# EAGLE design power_supply (EAGLE 7.5.0)
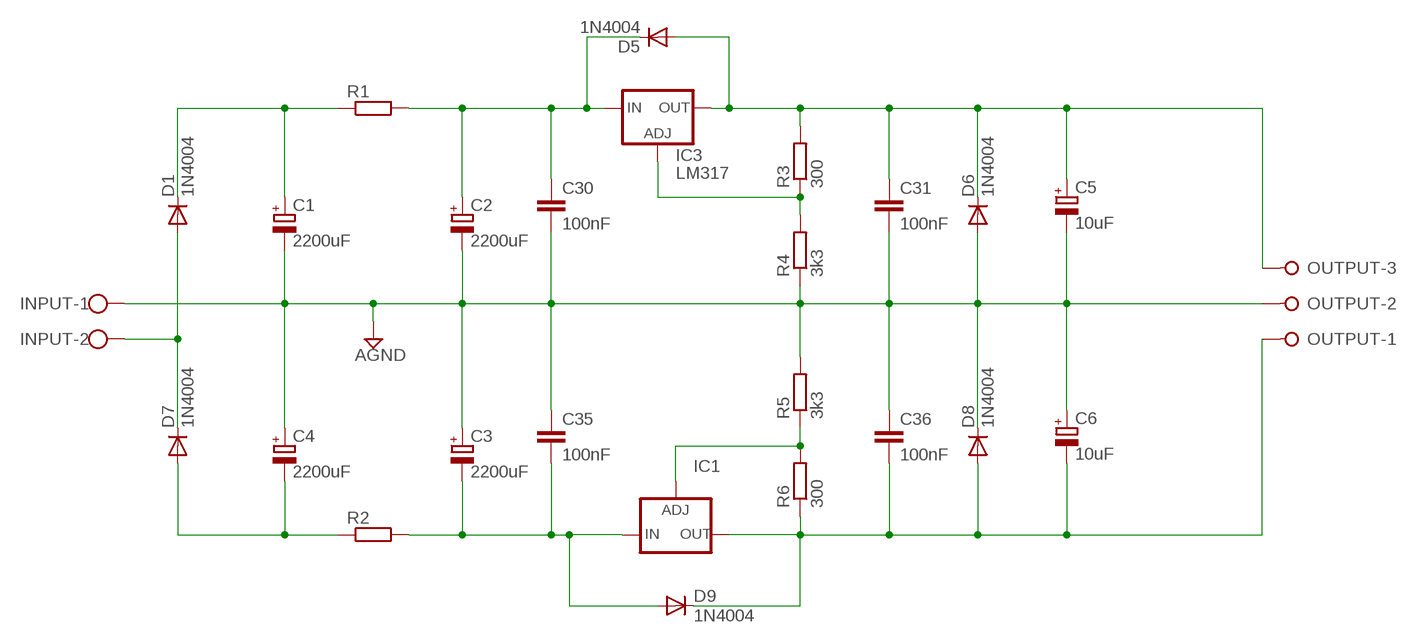
[diagram p0: schematic, sheet 1]

## Parts
C1  2200uF  CPOL-EUE7.5-16  [E7,5-16]
C2  2200uF  CPOL-EUE7.5-16  [E7,5-16]
C3  2200uF  CPOL-EUE7.5-16  [E7,5-16]
C4  2200uF  CPOL-EUE7.5-16  [E7,5-16]
C5  10uF  CPOL-EUE2.5-5  [E2,5-5]
C6  10uF  CPOL-EUE2.5-5  [E2,5-5]
C30  100nF  C-EU050-025X075  [C050-025X075]
C31  100nF  C-EU050-025X075  [C050-025X075]
C35  100nF  C-EU050-025X075  [C050-025X075]
C36  100nF  C-EU050-025X075  [C050-025X075]
D1  1N4004  [DO41-10]
D5  1N4004  [DO41-10]
D6  1N4004  [DO41-10]
D7  1N4004  [DO41-10]
D8  1N4004  [DO41-10]
D9  1N4004  [DO41-10]
IC1  LM337TS  [337TS]
IC3  LM317  LM317TS  [317TS]
INPUT  W237-102  [W237-102]
OUTPUT  W237-3E  [W237-3E]
R1  R-EU_0207/10  [0207/10]
R2  R-EU_0207/10  [0207/10]
R3  300  R-EU_0207/7  [0207/7]
R4  3k3  R-EU_0207/7  [0207/7]
R5  3k3  R-EU_0207/7  [0207/7]
R6  300  R-EU_0207/7  [0207/7]

## Nets
AGND: C1.- C2.- C3.+ C4.+ C5.- C6.+ C30.2 C31.2 C35.1 C36.1 D6.A D8.C INPUT.1 OUTPUT.2 R4.1 R5.2
N$1: IC1.1(ADJ) R5.1 R6.2
N$2: D1.A D7.C INPUT.2
N$3: C6.- C36.2 D8.A D9.C IC1.3(OUT) OUTPUT.1 R6.1
N$5: C5.+ C31.1 D5.A D6.C IC3.2(OUT) OUTPUT.3 R3.2
N$6: C2.+ C30.1 D5.C IC3.3(IN) R1.2
N$7: IC3.1(ADJ) R3.1 R4.2
N$8: C1.+ D1.C R1.1
N$9: C3.- C35.2 D9.A IC1.2(IN) R2.2
N$10: C4.- D7.A R2.1

## Library data of the parts
C1-C6 = rcl:CPOL-EU: POLARIZED CAPACITOR, European symbol
C30 C31 C35 C36 = rcl:C-EU: CAPACITOR, European symbol
D1 D5-D9 = adafruit:1N4004: DIODE General purpose 1N400x type rectifier (With bigger pads) http://www.ladyada.net/library/pcb/eaglelibrary.html
IC1 = v-reg:LM337TS: VOLTAGE REGULATOR
IC3 = v-reg:LM317TS: VOLTAGE REGULATOR
INPUT = con-wago-500:W237-102: WAGO SCREW CLAMP; MPN: 237-102; OC_FARNELL: unknown; OC_NEWARK: 70K9898
OUTPUT = con-wago-508:W237-3E: WAGO SREW CLAMP; OC_FARNELL: unknown; OC_NEWARK: unknown
R1-R6 = rcl:R-EU_: RESISTOR, European symbol

## Board
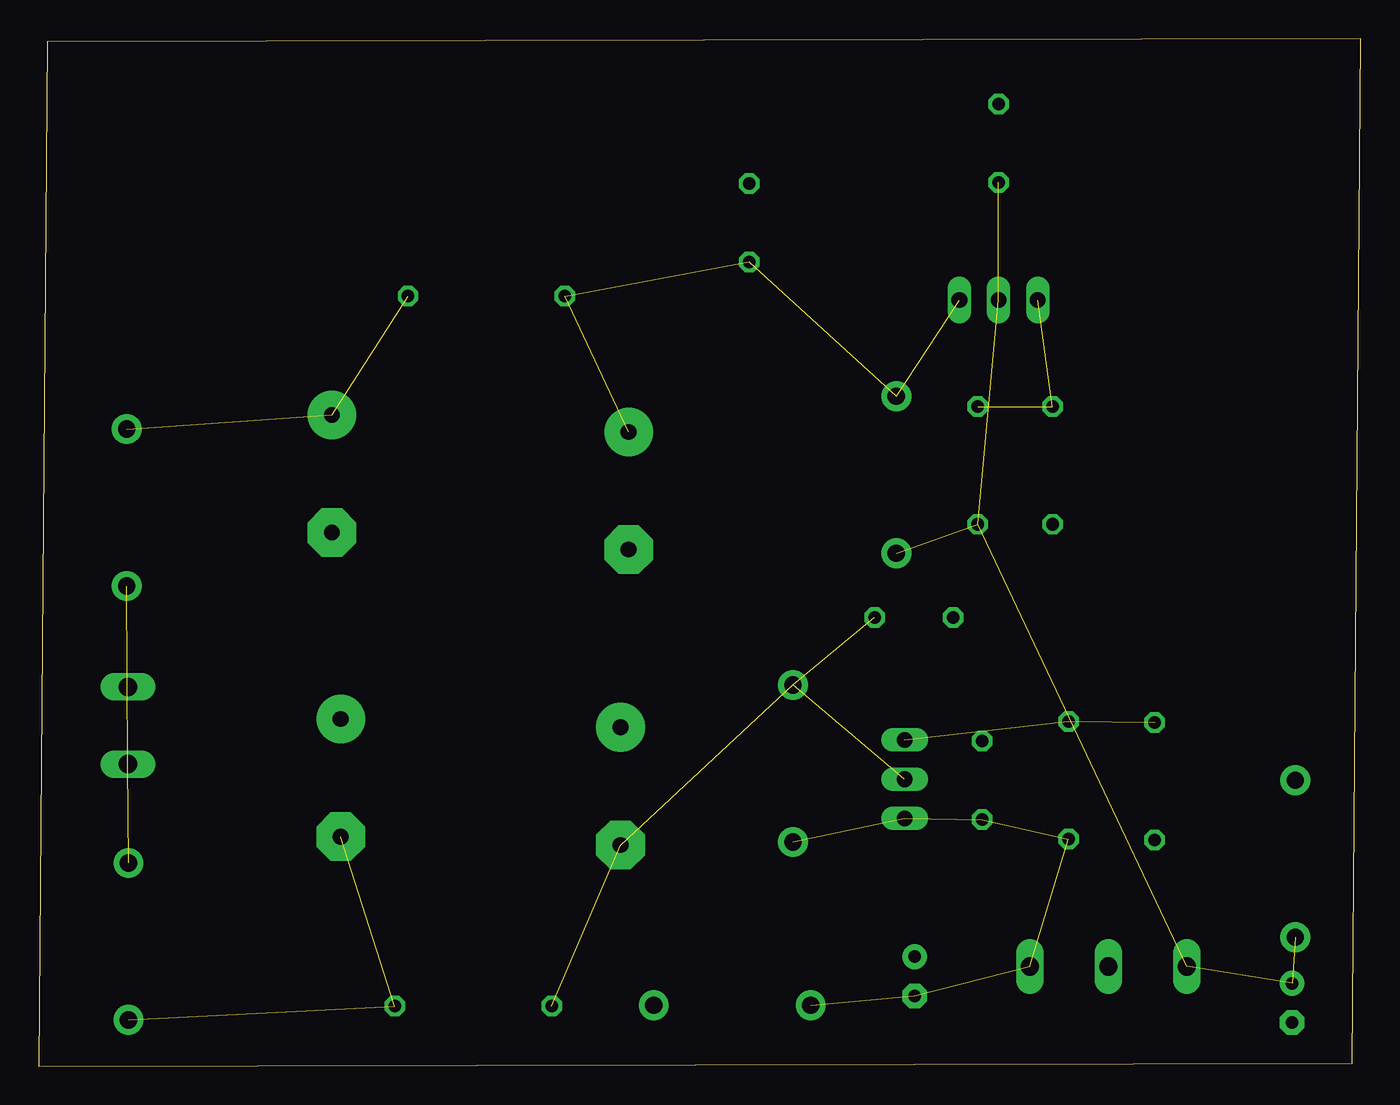
[diagram p1: board, top side]
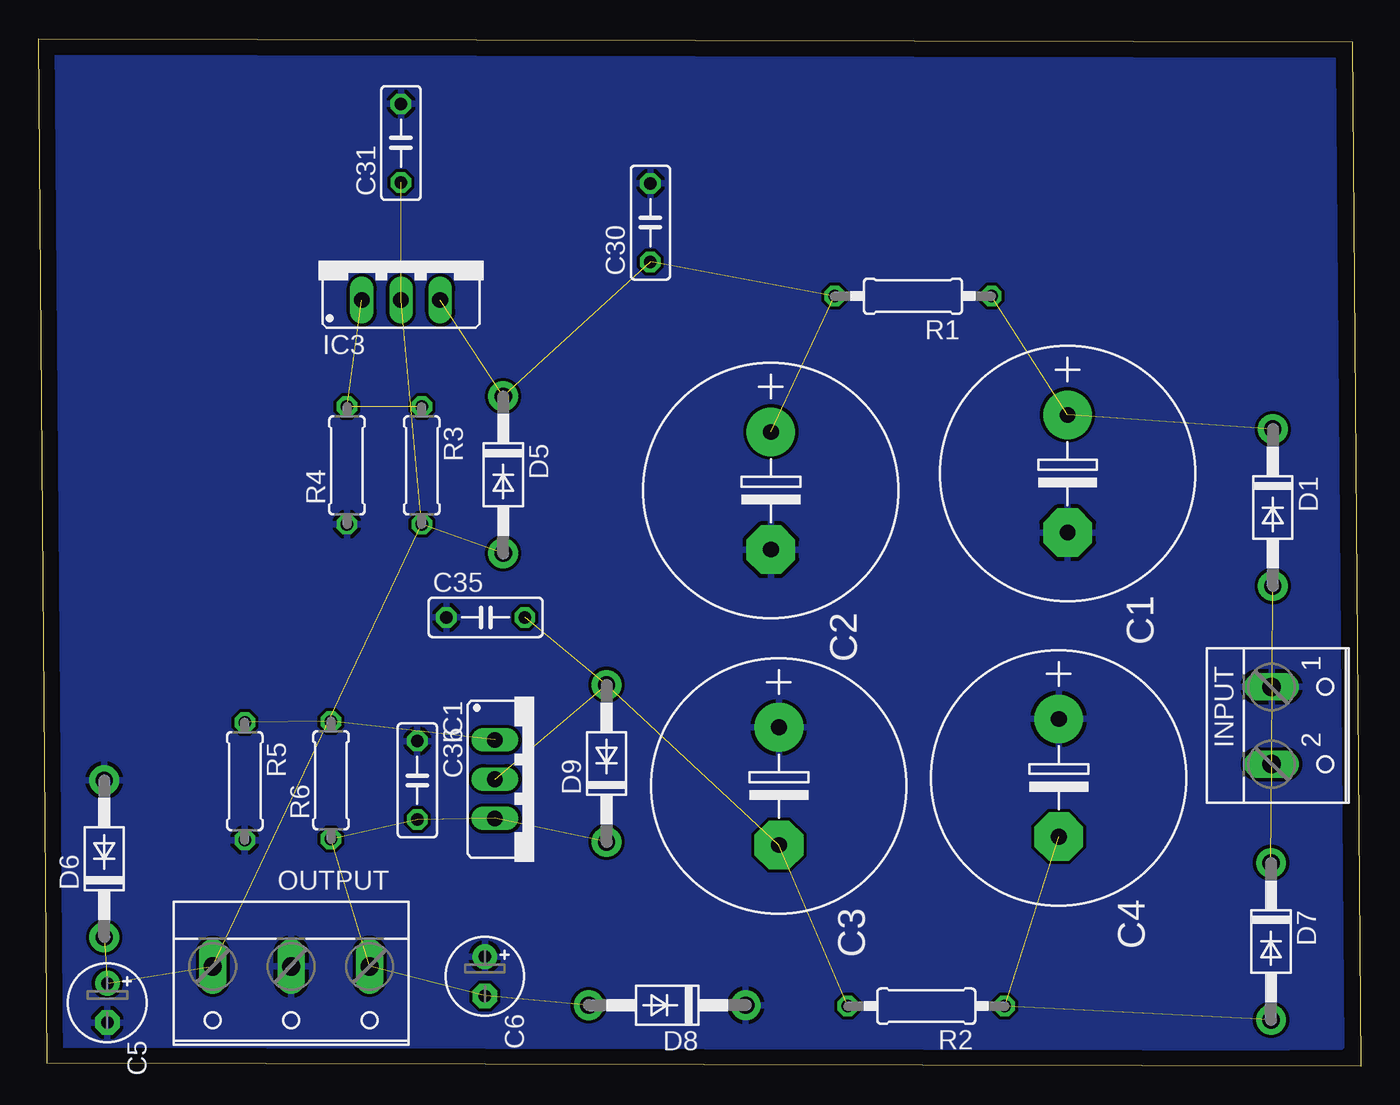
[diagram p2: board, bottom side, seen from below]

Size 85.61 x 66.51 mm. Coordinates in mm from the lower left corner, seen from the top.
Outline: 0,0 85.04,0.19 85.61,66.51 0.57,66.32 0,0
Copper layers (1*16): Top 0.035mm / dielectric 1.5mm / Bottom 0.035mm
Design rules "default": minimum track width 10mil, minimum drill 24mil, track to track 8mil, track to pad 8mil, pad to pad 8mil, via to via 8mil, smd to smd 8mil, copper to edge 40mil, drill to drill 8mil, minimum pad ring 10mil, minimum via ring 8mil, stop-mask expansion 4mil, vias tented up to drill 0mil, thermal gap 10mil

### Footprints (pad centres in the part's own frame; a part is rotated, then mirrored left to right if it is on the bottom)
E7,5-16 = drill 1.016 pad 3.15: + -3.81,0 | drill 1.016 pad 3.15 octagon: - 3.81,0
E2,5-5 = drill 0.813 pad 1.6: + -1.27,0 | drill 0.813 pad 1.6 octagon: - 1.27,0
C050-025X075 = drill 0.813 octagon: 1 -2.54,0; 2 2.54,0
DO41-10 = drill 1.118 pad 1.93: A 5.08,0; C -5.08,0
337TS = drill 1.016 long: 1 -2.54,-2.54; 2 0,-2.54; 3 2.54,-2.54
317TS = drill 1.016 long: 1 -2.54,-2.54; 2 0,-2.54; 3 2.54,-2.54
W237-102 = drill 1.194 long: 1 -2.5,-1.27; 2 2.5,-1.27
W237-3E = drill 1.194 long: 1 -5.08,-0.635; 2 0,-0.635; 3 5.08,-0.635
0207/10 = drill 0.813 octagon: 1 -5.08,0; 2 5.08,0
0207/7 = drill 0.813 octagon: 1 -3.81,0; 2 3.81,0

### Placement (x,y rotation side)
C1  18.99,38.35 270 bottom
C2  38.2,37.25 270 bottom
C3  37.68,18.13 270 bottom
C4  19.56,18.67 270 bottom
C5  81.16,4.1 270 bottom
C6  56.72,5.82 270 bottom
C30  46,54.6 90 bottom
C31  62.15,59.75 90 bottom
C35  56.67,29.05 0 bottom
C36  61.09,18.51 270 bottom
D1  5.7,36.16 270 bottom
D5  55.53,38.28 270 bottom
D6  81.36,13.43 90 bottom
D7  5.82,8.08 270 bottom
D8  44.91,3.95 180 bottom
D9  48.84,19.6 90 bottom
IC1  53.53,18.58 270 bottom
IC3  62.15,52.13 0 bottom
INPUT  4.51,22.05 270 bottom
OUTPUT  69.26,5.83 180 bottom
R1  29,49.84 180 bottom
R2  28.14,3.89 180 bottom
R3  60.8,38.89 270 bottom
R4  65.65,38.89 90 bottom
R5  72.26,18.45 270 bottom
R6  66.68,18.51 90 bottom

### Tracks (layer width: path | path; a pad name or v marks a point on that pad's centre or on a via)
AGND
  pour Bottom: 1.83,65.19 84.75,65.49 85.32,0.45 1.27,1.27
N$1  (2 unrouted)
N$2  (2 unrouted)
N$3  (6 unrouted)
N$5  (6 unrouted)
N$6  (4 unrouted)
N$7  (2 unrouted)
N$8  (2 unrouted)
N$9  (4 unrouted)
N$10  (2 unrouted)